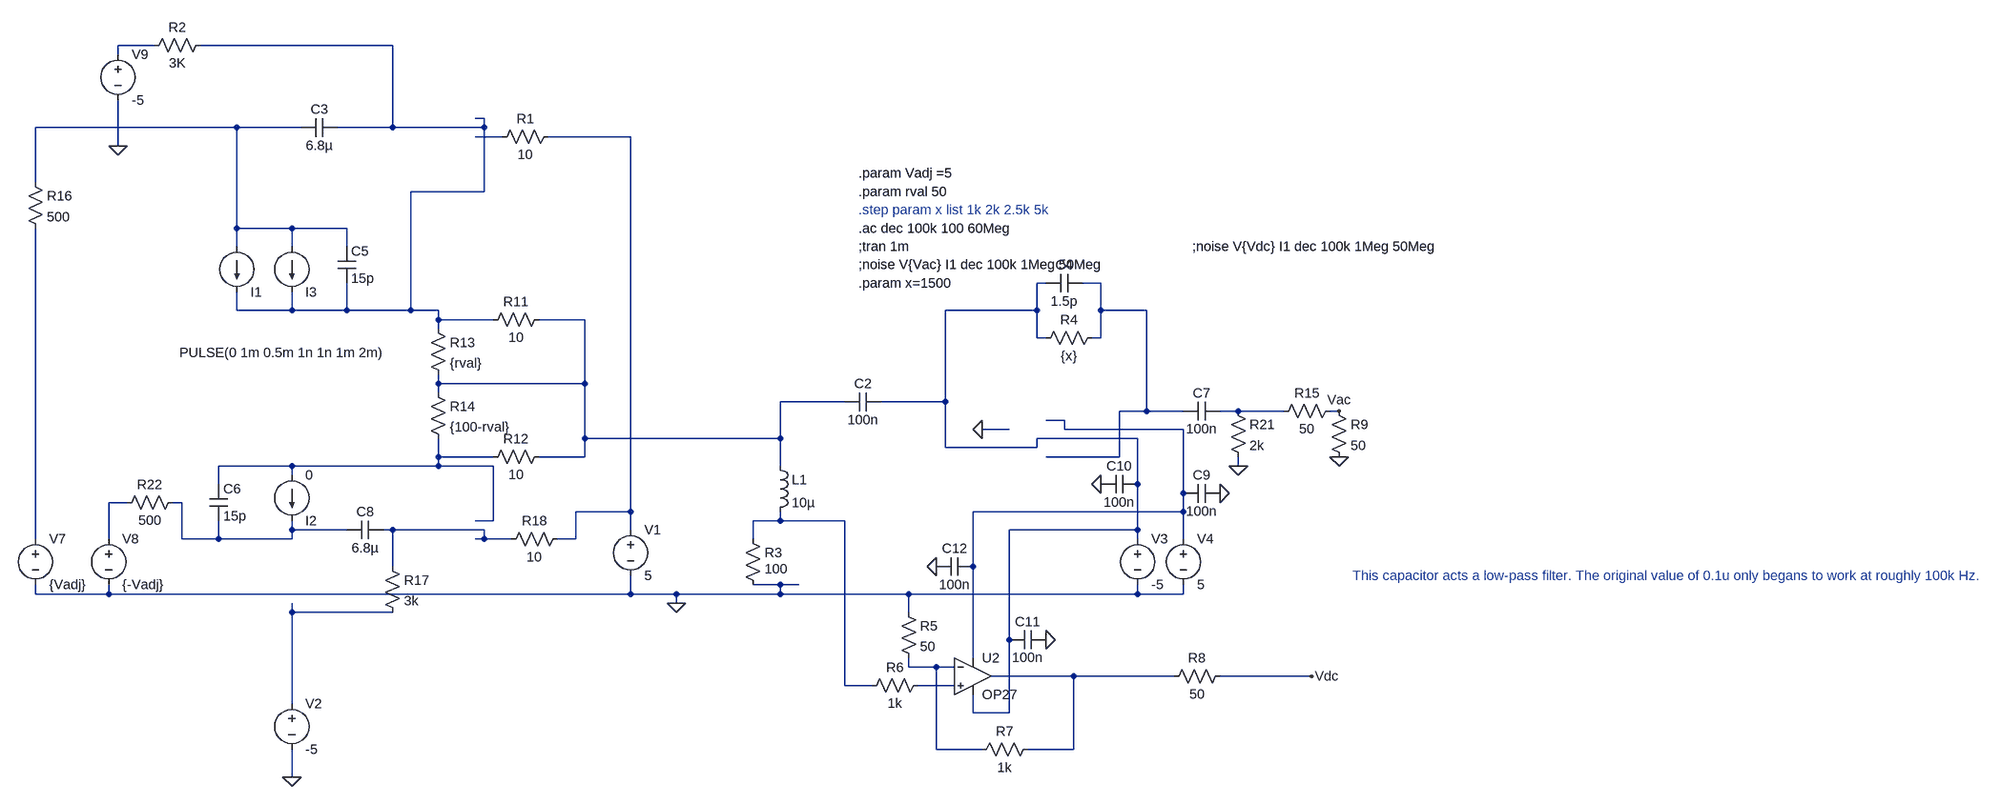
[diagram p0: schematic ideal.asc]
ideal.asc, the LTspice schematic file:
Version 4.1
SHEET 1 2808 976
WIRE -576 -400 -640 -400
WIRE -160 -400 -496 -400
WIRE -640 -384 -640 -400
WIRE 0 -272 -16 -272
WIRE -432 -256 -784 -256
WIRE -320 -256 -432 -256
WIRE -160 -256 -160 -400
WIRE -160 -256 -256 -256
WIRE 0 -256 0 -272
WIRE 0 -256 -160 -256
WIRE 32 -240 -16 -240
WIRE 256 -240 112 -240
WIRE -640 -224 -640 -304
WIRE -784 -160 -784 -256
WIRE 0 -144 0 -256
WIRE 0 -144 -128 -144
WIRE -432 -80 -432 -256
WIRE -336 -80 -432 -80
WIRE -240 -80 -336 -80
WIRE -432 -48 -432 -80
WIRE -336 -48 -336 -80
WIRE -240 -48 -240 -80
WIRE 1072 16 1056 16
WIRE 1168 16 1136 16
WIRE -432 64 -432 32
WIRE -336 64 -336 32
WIRE -336 64 -432 64
WIRE -240 64 -240 16
WIRE -240 64 -336 64
WIRE -128 64 -128 -144
WIRE -128 64 -240 64
WIRE -80 64 -128 64
WIRE 1056 64 1056 16
WIRE 1056 64 896 64
WIRE 1168 64 1168 16
WIRE 1248 64 1168 64
WIRE -80 80 -80 64
WIRE 16 80 -80 80
WIRE 176 80 96 80
WIRE -80 96 -80 80
WIRE 1056 112 1056 64
WIRE 1072 112 1056 112
WIRE 1168 112 1168 64
WIRE 1168 112 1152 112
WIRE -80 192 -80 176
WIRE 176 192 176 80
WIRE 176 192 -80 192
WIRE -80 208 -80 192
WIRE 720 224 608 224
WIRE 896 224 896 64
WIRE 896 224 784 224
WIRE 1248 240 1248 64
WIRE 1248 240 1200 240
WIRE 1312 240 1248 240
WIRE 1408 240 1376 240
WIRE 1488 240 1408 240
WIRE 1584 240 1568 240
WIRE 1104 256 1072 256
WIRE 1008 272 960 272
WIRE 1104 272 1104 256
WIRE 1312 272 1104 272
WIRE 176 288 176 192
WIRE 608 288 608 224
WIRE 608 288 176 288
WIRE 1232 288 1056 288
WIRE 896 304 896 224
WIRE 1056 304 1056 288
WIRE 1056 304 896 304
WIRE -80 320 -80 288
WIRE 16 320 -80 320
WIRE 176 320 176 288
WIRE 176 320 96 320
WIRE 1200 320 1200 240
WIRE 1200 320 1072 320
WIRE -336 336 -464 336
WIRE -80 336 -80 320
WIRE -80 336 -336 336
WIRE 16 336 -80 336
WIRE 608 336 608 288
WIRE 1408 336 1408 320
WIRE -336 352 -336 336
WIRE -464 368 -464 336
WIRE 1232 368 1232 288
WIRE 1312 384 1312 272
WIRE -624 400 -656 400
WIRE -528 400 -544 400
WIRE 256 416 256 -240
WIRE 256 416 160 416
WIRE 1312 416 1312 384
WIRE 1312 416 944 416
WIRE 16 432 16 336
WIRE 16 432 -16 432
WIRE 608 432 608 416
WIRE 608 432 560 432
WIRE 720 432 608 432
WIRE -336 448 -336 432
WIRE -240 448 -336 448
WIRE -160 448 -176 448
WIRE 0 448 -160 448
WIRE 256 448 256 416
WIRE 1232 448 1232 368
WIRE 1232 448 1008 448
WIRE -784 464 -784 -80
WIRE -656 464 -656 400
WIRE -528 464 -528 400
WIRE -464 464 -464 432
WIRE -464 464 -528 464
WIRE -336 464 -336 448
WIRE -336 464 -464 464
WIRE 0 464 0 448
WIRE 0 464 -16 464
WIRE 48 464 0 464
WIRE 160 464 160 416
WIRE 160 464 128 464
WIRE 560 464 560 432
WIRE 1232 464 1232 448
WIRE 1312 464 1312 416
WIRE -160 512 -160 448
WIRE 944 512 944 416
WIRE 608 544 560 544
WIRE 640 544 608 544
WIRE -784 560 -784 544
WIRE -656 560 -656 544
WIRE -656 560 -784 560
WIRE 256 560 256 528
WIRE 256 560 -656 560
WIRE 336 560 256 560
WIRE 608 560 608 544
WIRE 608 560 336 560
WIRE 832 560 608 560
WIRE 1232 560 1232 544
WIRE 1232 560 832 560
WIRE 1312 560 1312 544
WIRE 1312 560 1232 560
WIRE 336 576 336 560
WIRE -336 592 -336 576
WIRE -160 592 -336 592
WIRE 832 592 832 560
WIRE 1008 640 1008 448
WIRE 944 672 944 512
WIRE 832 688 832 672
WIRE 880 688 832 688
WIRE 912 688 880 688
WIRE 1120 704 976 704
WIRE 1296 704 1120 704
WIRE 1536 704 1376 704
WIRE 720 720 720 432
WIRE 768 720 720 720
WIRE 912 720 848 720
WIRE -336 752 -336 592
WIRE 944 768 944 736
WIRE 1008 768 1008 640
WIRE 1008 768 944 768
WIRE 880 832 880 688
WIRE 960 832 880 832
WIRE 1120 832 1120 704
WIRE 1120 832 1040 832
WIRE -336 880 -336 832
FLAG 336 576 0
FLAG 1536 704 Vdc
FLAG -640 -224 0
FLAG -336 880 0
FLAG 1408 336 0
FLAG 1584 240 Vac
FLAG 1072 640 0
FLAG 880 512 0
FLAG 960 272 0
FLAG 1168 368 0
FLAG 1376 384 0
FLAG 1584 320 0
DATAFLAG 1488 704 ""
SYMBOL current -432 -48 R0
WINDOW 0 24 80 Left 2
WINDOW 3 -100 186 Left 2
WINDOW 39 0 0 Left 0
SYMATTR InstName I1
SYMATTR Value PULSE(0 1m 0.5m 1n 1n 1m 2m)
SYMATTR Value2 AC 1 0
SYMBOL current -336 352 R0
WINDOW 0 24 80 Left 2
WINDOW 3 24 0 Left 2
WINDOW 123 0 0 Left 0
WINDOW 39 0 0 Left 0
SYMATTR InstName I2
SYMATTR Value 0
SYMBOL res 544 448 R0
WINDOW 3 36 68 Left 2
SYMATTR Value 100
SYMATTR InstName R3
SYMBOL voltage 1232 448 R0
WINDOW 123 0 0 Left 0
WINDOW 39 0 0 Left 0
SYMATTR InstName V3
SYMATTR Value -5
SYMBOL voltage 1312 448 R0
WINDOW 123 0 0 Left 0
WINDOW 39 0 0 Left 0
SYMATTR InstName V4
SYMATTR Value 5
SYMBOL res 1168 96 R90
WINDOW 0 0 56 VBottom 2
WINDOW 3 32 56 VTop 2
SYMATTR InstName R4
SYMATTR Value {x}
SYMBOL cap 1136 0 R90
WINDOW 0 0 32 VBottom 2
WINDOW 3 32 32 VTop 2
SYMATTR InstName C4
SYMATTR Value 1.5p
SYMBOL current -336 -48 R0
WINDOW 0 24 80 Left 2
WINDOW 3 24 0 Invisible 2
WINDOW 123 0 0 Left 0
WINDOW 39 0 0 Left 0
SYMATTR InstName I3
SYMATTR Value 0
SYMBOL OpAmps\\OP27 944 640 R0
SYMATTR InstName U2
SYMBOL res 816 576 R0
SYMATTR InstName R5
SYMATTR Value 50
SYMBOL res 864 704 R90
WINDOW 0 0 56 VBottom 2
WINDOW 3 32 56 VTop 2
SYMATTR InstName R6
SYMATTR Value 1k
SYMBOL res 1056 816 R90
WINDOW 0 0 56 VBottom 2
WINDOW 3 32 56 VTop 2
SYMATTR InstName R7
SYMATTR Value 1k
SYMBOL res 1392 688 R90
WINDOW 0 0 56 VBottom 2
WINDOW 3 32 56 VTop 2
SYMATTR InstName R8
SYMATTR Value 50
SYMBOL cap -256 -48 R0
SYMATTR InstName C5
SYMATTR Value 15p
SYMBOL cap -480 368 R0
SYMATTR InstName C6
SYMATTR Value 15p
SYMBOL res 112 64 R90
WINDOW 0 0 56 VBottom 2
WINDOW 3 32 56 VTop 2
SYMATTR InstName R11
SYMATTR Value 10
SYMBOL res 112 304 R90
WINDOW 0 0 56 VBottom 2
WINDOW 3 32 56 VTop 2
SYMATTR InstName R12
SYMATTR Value 10
SYMBOL res -96 80 R0
SYMATTR InstName R13
SYMATTR Value {rval}
SYMBOL res -96 192 R0
SYMATTR InstName R14
SYMATTR Value {100-rval}
SYMBOL voltage -784 448 R0
WINDOW 123 0 0 Left 0
WINDOW 39 0 0 Left 0
SYMATTR InstName V7
SYMATTR Value {Vadj}
SYMBOL voltage -656 448 R0
WINDOW 123 0 0 Left 0
WINDOW 39 0 0 Left 0
SYMATTR InstName V8
SYMATTR Value {-Vadj}
SYMBOL voltage 256 432 R0
WINDOW 123 0 0 Left 0
WINDOW 39 0 0 Left 0
SYMATTR InstName V1
SYMATTR Value 5
SYMBOL res 128 -256 R90
WINDOW 0 0 56 VBottom 2
WINDOW 3 32 56 VTop 2
SYMATTR InstName R1
SYMATTR Value 10
SYMBOL cap -256 -272 R90
WINDOW 0 0 32 VBottom 2
WINDOW 3 32 32 VTop 2
SYMATTR InstName C3
SYMATTR Value 6.8µ
SYMBOL voltage -640 -400 R0
WINDOW 123 0 0 Left 0
WINDOW 39 0 0 Left 0
SYMATTR InstName V9
SYMATTR Value -5
SYMBOL res -480 -416 R90
WINDOW 0 0 56 VBottom 2
WINDOW 3 32 56 VTop 2
SYMATTR InstName R2
SYMATTR Value 3K
SYMBOL res -800 -176 R0
SYMATTR InstName R16
SYMATTR Value 500
SYMBOL voltage -336 736 R0
WINDOW 123 0 0 Left 0
WINDOW 39 0 0 Left 0
SYMATTR InstName V2
SYMATTR Value -5
SYMBOL res -176 496 R0
SYMATTR InstName R17
SYMATTR Value 3k
SYMBOL cap -176 432 R90
WINDOW 0 0 32 VBottom 2
WINDOW 3 32 32 VTop 2
SYMATTR InstName C8
SYMATTR Value 6.8µ
SYMBOL res 144 448 R90
WINDOW 0 0 56 VBottom 2
WINDOW 3 32 56 VTop 2
SYMATTR InstName R18
SYMATTR Value 10
SYMBOL cap 1376 224 R90
WINDOW 0 0 32 VBottom 2
WINDOW 3 32 32 VTop 2
SYMATTR InstName C7
SYMATTR Value 100n
SYMBOL res 1392 224 R0
SYMATTR InstName R21
SYMATTR Value 2k
SYMBOL res -528 384 R90
WINDOW 0 0 56 VBottom 2
WINDOW 3 32 56 VTop 2
SYMATTR InstName R22
SYMATTR Value 500
SYMBOL res 1584 224 R90
WINDOW 0 0 56 VBottom 2
WINDOW 3 32 56 VTop 2
SYMATTR InstName R15
SYMATTR Value 50
SYMBOL cap 1072 624 R90
WINDOW 0 0 32 VBottom 2
WINDOW 3 32 32 VTop 2
SYMATTR InstName C11
SYMATTR Value 100n
SYMBOL cap 944 496 R90
WINDOW 0 0 32 VBottom 2
WINDOW 3 32 32 VTop 2
SYMATTR InstName C12
SYMATTR Value 100n
SYMBOL cap 784 208 R90
WINDOW 0 0 32 VBottom 2
WINDOW 3 32 32 VTop 2
SYMATTR InstName C2
SYMATTR Value 100n
SYMBOL cap 1376 368 R90
WINDOW 0 0 32 VBottom 2
WINDOW 3 32 32 VTop 2
SYMATTR InstName C9
SYMATTR Value 100n
SYMBOL cap 1232 352 R90
WINDOW 0 0 32 VBottom 2
WINDOW 3 32 32 VTop 2
SYMATTR InstName C10
SYMATTR Value 100n
SYMBOL res 1568 224 R0
SYMATTR InstName R9
SYMATTR Value 50
SYMBOL ind 592 320 R0
SYMATTR InstName L1
SYMATTR Value 10µ
TEXT 744 -112 Left 2 ;.step param x list 1k 2k 2.5k 5k
TEXT 744 -48 Left 2 !;tran 1m
TEXT 744 -144 Left 2 !.param rval 50
TEXT 744 -176 Left 2 !.param Vadj =5
TEXT 744 -80 Left 2 !.ac dec 100k 100 60Meg
TEXT 1608 528 Left 2 ;This capacitor acts a low-pass filter. The original value of 0.1u only begans to work at roughly 100k Hz.
TEXT 744 -16 Left 2 !;noise V{Vac} I1 dec 100k 1Meg 50Meg
TEXT 744 16 Left 2 !.param x=1500
TEXT 1328 -48 Left 2 !;noise V{Vdc} I1 dec 100k 1Meg 50Meg

The netlist it stands for:
* ideal.asc
I1 N003 N002 PULSE(0 1m 0.5m 1n 1n 1m 2m) AC 1 0
I2 N011 N013 0
R3 N014 0 100
V3 N006 0 -5
V4 N010 0 5
R4 N007 N006 {x}
C4 N007 N006 1.5p
I3 N003 N002 0
X§U2 N020 N018 N010 N006 N019 OP27  ; pins In+ In- V+ V- OUT
R5 0 N018 50
R6 N020 N014 1k
R7 N019 N018 1k
R8 Vdc N019 50
C5 N003 N002 15p
C6 N011 N013 15p
R11 N008 N002 10
R12 N008 N011 10
R13 N002 N008 {rval}
R14 N008 N011 {100-rval}
V7 N016 0 {Vadj}
V8 N012 0 {-Vadj}
V1 N005 0 5
R1 N005 N004 10
C3 N002 N003 6.8µ
V9 N001 0 -5
R2 N002 N001 3K
R16 N003 N016 500
V2 N017 0 -5
R17 N015 N017 3k
C8 N015 N013 6.8µ
R18 N005 N015 10
C7 N009 N007 100n
R21 N009 0 2k
R22 N013 N012 500
R15 Vac N009 50
C11 0 N006 100n
C12 N010 0 100n
C2 N006 N008 100n
C9 0 N010 100n
C10 N006 0 100n
R9 Vac 0 50
L1 N008 N014 10µ
* .step param x list 1k 2k 2.5k 5k
;tran 1m
.param rval 50
.param Vadj =5
.ac dec 100k 100 60Meg
* This capacitor acts a low-pass filter. The original value of 0.1u only begans to work at roughly 100k Hz.
;noise V{Vac} I1 dec 100k 1Meg 50Meg
.param x=1500
;noise V{Vdc} I1 dec 100k 1Meg 50Meg
.lib ADI.lib
.backanno
.end